# Altium project Base_borne_MEP_1.PrjPcb
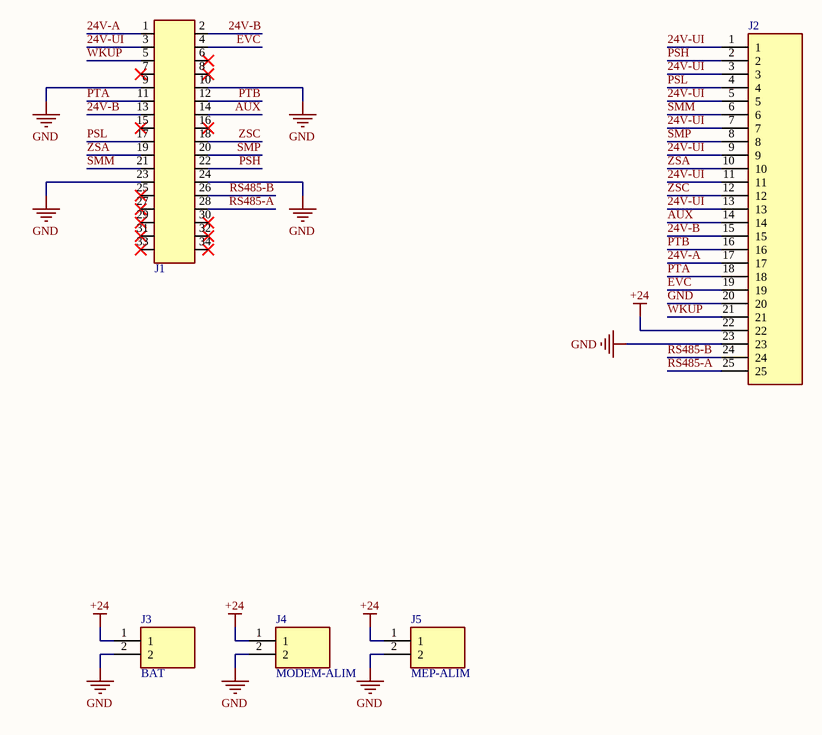
[diagram p0: Base_borne_conn.SchDoc]
1 sheet, 5 parts. Net scope: global (net labels, ports and power ports of the same name join across sheets).
Board file: Base_borne_conn.PcbDoc

## Sheet Base_borne_conn.SchDoc
size A4

### Parts
J1  6120XX21621_61203421621  [61203421621]  (value not drawn)
J2  1769-25  [1769-25]  (value not drawn)
J3  BAT  [1769463]
J4  MODEM-ALIM  [1769463]
J5  MEP-ALIM  [1769463]

### Nets
+24: J2.22 J3.1 J4.1 J5.1
GND: J1.9 J1.10 J1.23 J1.24 J2.20 J2.23 J3.2 J4.2 J5.2
24V-A: J1.1 J2.17
24V-B: J1.2 J1.13 J2.15
24V-UI: J1.3 J2.1 J2.3 J2.5 J2.7 J2.9 J2.11 J2.13
AUX: J1.14 J2.14
EVC: J1.4 J2.19
PSH: J1.22 J2.2
PSL: J1.17 J2.4
PTA: J1.11 J2.18
PTB: J1.12 J2.16
RS485-A: J1.28 J2.25
RS485-B: J1.26 J2.24
SMM: J1.21 J2.6
SMP: J1.20 J2.8
WKUP: J1.5 J2.21
ZSA: J1.19 J2.10
ZSC: J1.18 J2.12

Not connected (* = marked no-connect by the designer): J1 6* 7* 8* 15* 16* 25* 27* 29* 30* 31* 32* 33* 34*

### Library data of the parts
J1 = 6120XX21621_61203421621: 34 pins, straight, gold plating; MF: Wurth Electronics; SnapEDA_Link: https://www.snapeda.com/parts/61203421621/Wurth+Electronics/view-part/?ref=snap; Package: None; Value: *; MP: 61203421621; Check_prices: https://www.snapeda.com/parts/61203421621/Wurth+Electronics/view-part/?ref=eda
J3 = 1769463_1: Connector; Manufacturer_Name: Phoenix Contact; Datasheet Link: https://www.phoenixcontact.com/en-us/products/pcb-header-smstb-25-2-g-508-1769463?type=pdf; Height: 14.95mm; Manufacturer_Part_Number: 1769463
J4 = 1769463_2: Connector; Manufacturer_Name: Phoenix Contact; Datasheet Link: https://www.phoenixcontact.com/en-us/products/pcb-header-smstb-25-2-g-508-1769463?type=pdf; Height: 14.95mm; Manufacturer_Part_Number: 1769463
J5 = 1769463: Connector; Manufacturer_Name: Phoenix Contact; Datasheet Link: https://www.phoenixcontact.com/en-us/products/pcb-header-smstb-25-2-g-508-1769463?type=pdf; Height: 14.95mm; Manufacturer_Part_Number: 1769463